# Altium project 单体V0.3.PrjPcb
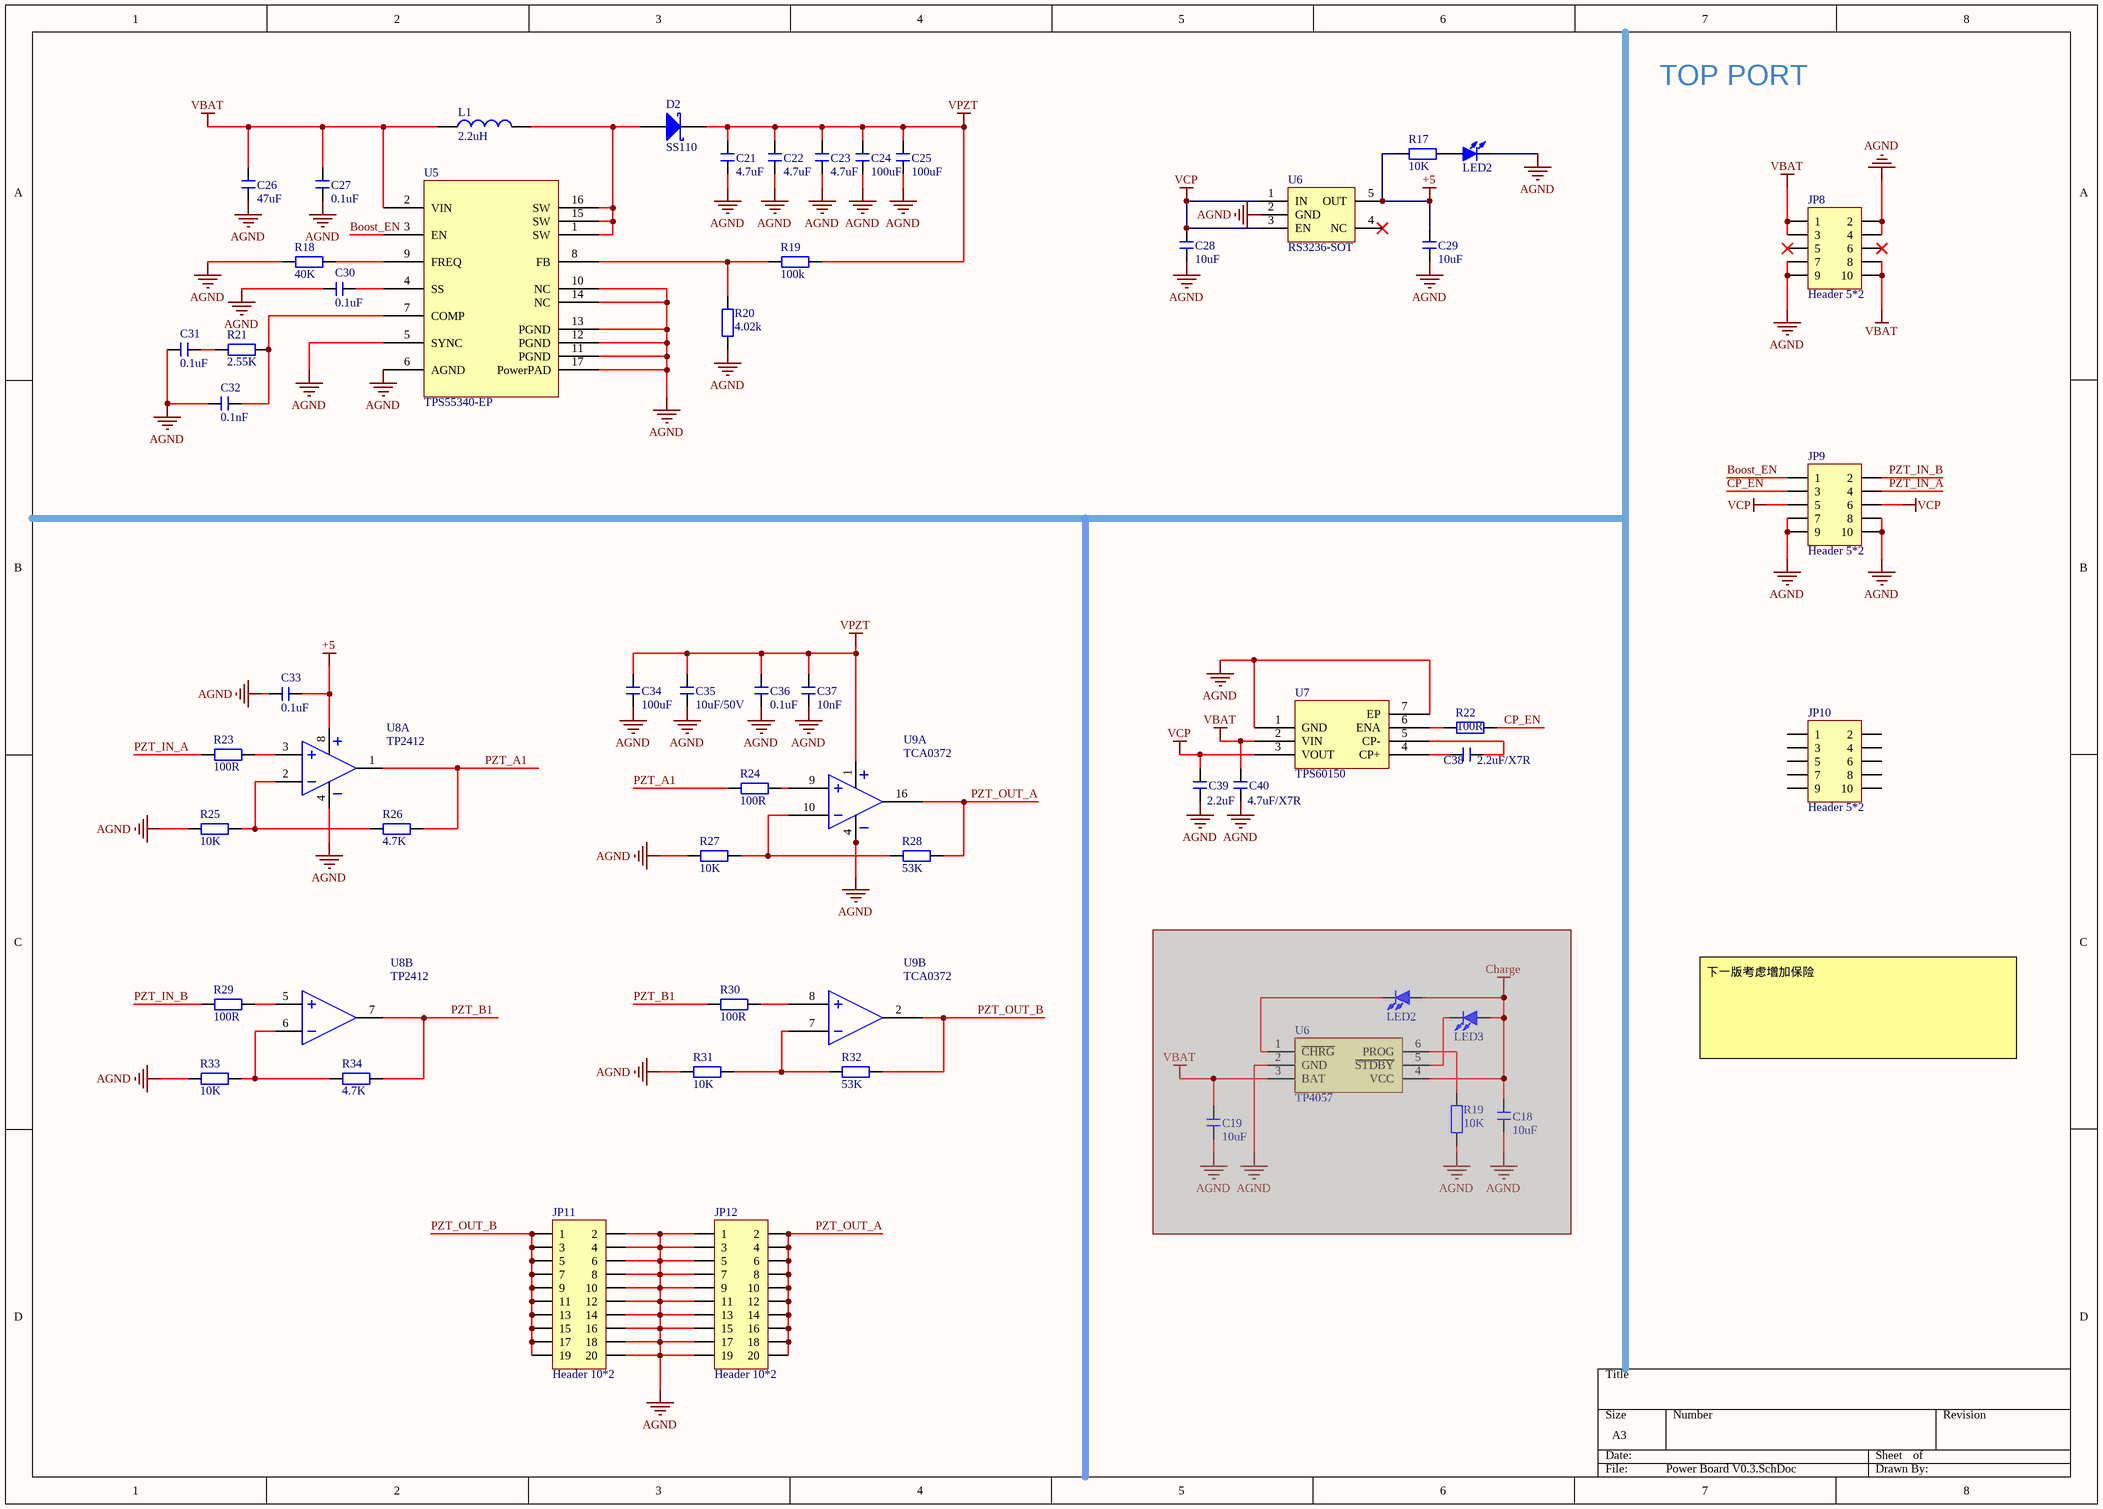
[diagram p0: Power Board V0.3.SchDoc]
2 sheets, 61 parts. Net scope: global (net labels, ports and power ports of the same name join across sheets).
Board files: Power Board V0.3.PcbDoc, Controller Board V0.3.PcbDoc, Function Board V0.3.PcbDoc, PZT Board.PcbDoc, DAP Board V0.3.PcbDoc
Sheets:
  Power Board V0.3.SchDoc
  DAP Board V0.3.SchDoc

## Sheet Power Board V0.3.SchDoc
size A3; SheetNumber: 1; SheetTotal: 4

### Parts
(Parts that share a designator on the sheet are numbered #1, #2 ... from top to bottom, then left to right.)
C18  10uF  [C 0603_L]  (masked out: inside a compile mask, not in the netlist)
C19  10uF  [C 0603_L]  (masked out: inside a compile mask, not in the netlist)
C21  4.7uF  [C 0603_L]
C22  4.7uF  [C 0603_L]
C23  4.7uF  [C 0603_L]
C24  100uF  [C 1206_L]
C25  100uF  [C 1206_L]
C26  47uF  [C 1206_L]
C27  0.1uF  [C 0603_L]
C28  10uF  [C 0603_L]
C29  10uF  [C 0603_L]
C30  0.1uF  [C 0603_L]
C31  0.1uF  [C 0603_L]
C32  0.1nF  [C 0603_L]
C33  0.1uF  [C 0603_L]
C34  100uF  [C 1206_L]
C35  10uF/50V  [C 0805_L]
C36  0.1uF  [C 0603_L]
C37  10nF  [C 0603_L]
C38  2.2uF/X7R  [C 0603_L]
C39  2.2uF  [C 0603_L]
C40  4.7uF/X7R  [C 0603_L]
D2  SS110  [SMA]
JP8  Header 5*2  [BTB-0.8mm-SMD-F-2*5PIN]
JP9  Header 5*2  [BTB-0.8mm-SMD-F-2*5PIN]
JP10  Header 5*2  [BTB-0.8mm-SMD-F-2*5PIN]
JP11  Header 10*2  [BTB-0.5MM-SMD-F_2*10PIN]
JP12  Header 10*2  [BTB-0.5MM-SMD-F_2*10PIN]
L1  2.2uH  [0530]
LED2#1  红色  [LED 0603G]  (value not drawn)
LED2#2  红色  [LED 0603R]  (value not drawn)  (masked out: inside a compile mask, not in the netlist)
LED3  红色  [LED 0603G]  (value not drawn)  (masked out: inside a compile mask, not in the netlist)
R17  10K  [R 0603_L]
R18  40K  [R 0603_L]
R19#1  100k  [R 0603_L]
R19#2  10K  [R 0603_L]  (masked out: inside a compile mask, not in the netlist)
R20  4.02k  [R 0603_L]
R21  2.55K  [R 0603_L]
R22  100R  [R 0603_L]
R23  100R  [R 0603_L]
R24  100R  [R 0603_L]
R25  10K  [R 0603_L]
R26  4.7K  [R 0603_L]
R27  10K  [R 0603_L]
R28  53K  [R 0603_L]
R29  100R  [R 0603_L]
R30  100R  [R 0603_L]
R31  10K  [R 0603_L]
R32  53K  [R 0603_L]
R33  10K  [R 0603_L]
R34  4.7K  [R 0603_L]
U5  TPS55340-EP  [QFN16]
U6#1  RS3236-SOT  [SOT23-5L]
U6#2  TP4057  [SOT23-6L]  (masked out: inside a compile mask, not in the netlist)
U7  TPS60150  [WSON-6Pin]
U8  TP2412  [MSOP8_L]  (parts A,B of 2)
U9  TCA0372  [SOP16W_N]  (parts A,B of 2)

### Nets
+5: C29.2 C33.2 R17.2 U6#1.5(OUT) U8.8(+Vs)
AGND: C21.1 C22.1 C23.1 C24.1 C25.1 C26.1 C27.1 C28.1 C29.1 C30.1 C31.1 C32.1 C33.1 C34.1 C35.1 C36.1 C37.2 C39.1 C40.1 JP8.2 JP8.4 JP8.7 JP8.9 JP9.7 JP9.8 JP9.9 JP9.10 JP11.2 JP11.4 JP11.6 JP11.8 JP11.10 JP11.12 JP11.14 JP11.16 JP11.18 JP11.20 JP12.1 JP12.3 JP12.5 JP12.7 JP12.9 JP12.11 JP12.13 JP12.15 JP12.17 JP12.19 LED2#1.2(K) R18.1 R20.1 R25.1 R27.1 R31.1 R33.1 U5.5(SYNC) U5.6(AGND) U5.10(NC) U5.11(PGND) U5.12(PGND) U5.13(PGND) U5.14(NC) U5.17(PowerPAD) U6#1.2(GND) U7.1(GND) U7.7(EP) U8.4(-Vs) U9.4(GND) U9.5(GND) U9.12(GND) U9.13(GND)
VBAT: C26.2 C27.2 C40.2 JP8.1 JP8.3 JP8.8 JP8.10 L1.1 U5.2(VIN) U7.2(VIN)
VCP: C28.2 C39.2 JP9.5 JP9.6 U6#1.1(IN) U6#1.3(EN) U7.3(VOUT)
VPZT: C21.2 C22.2 C23.2 C24.2 C25.2 C34.2 C35.2 C36.2 C37.1 D2.2(K) R19#1.2 U9.1
Boost_EN: JP9.1 U5.3(EN)
CP_EN: JP9.3 R22.1
PZT_A1: R24.1 R26.2 U8.1(Out)
PZT_B1: R30.1 R34.2 U8.7(Out)
PZT_IN_A: JP9.4 R23.1
PZT_IN_B: JP9.2 R29.1
PZT_OUT_A: JP12.2 JP12.4 JP12.6 JP12.8 JP12.10 JP12.12 JP12.14 JP12.16 JP12.18 JP12.20 R28.2 U9.16
PZT_OUT_B: JP11.1 JP11.3 JP11.5 JP11.7 JP11.9 JP11.11 JP11.13 JP11.15 JP11.17 JP11.19 R32.2 U9.2
NetC30_2: C30.2 U5.4(SS)
NetC31_2: C31.2 R21.1
NetC32_2: C32.2 R21.2 U5.7(COMP)
NetC38_1: C38.1 U7.4(CP+)
NetC38_2: C38.2 U7.5(CP-)
NetD2_1: D2.1(A) L1.2 U5.1(SW) U5.15(SW) U5.16(SW)
NetLED2#1_1: LED2#1.1(A) R17.1
NetR18_2: R18.2 U5.9(FREQ)
NetR19#1_1: R19#1.1 R20.2 U5.8(FB)
NetR22_2: R22.2 U7.6(ENA)
NetR23_2: R23.2 U8.3(In+)
NetR24_2: R24.2 U9.9
NetR25_2: R25.2 R26.1 U8.2(In-)
NetR27_2: R27.2 R28.1 U9.10
NetR29_2: R29.2 U8.5(In+)
NetR30_2: R30.2 U9.8
NetR31_2: R31.2 R32.1 U9.7
NetR33_2: R33.2 R34.1 U8.6(In-)

Not connected (* = marked no-connect by the designer): JP8 5* 6*; JP10 1 2 3 4 5 6 7 8 9 10; U6#1 4(NC)*

### Notes on the sheet
- TOP PORT
- 下一版考虑增加保险

### Library data of the parts
C18 C19 C21-C40 = C: 贴片电容; BOM名称: 无极性贴片电容; 淘宝ID: 封装库来自淘宝 ID：黄晶宝石; 联系售后: https://shop463601444.taobao.com
D2 = SS14: 肖特基二极管; 属性: 40V/1A; BOM名称: 肖特基二极管; 封装库来自淘宝 ID：黄晶宝石: https://shop463601444.taobao.com
JP8-JP10 = Header 5*2: BTB Connector
JP11 JP12 = Header 10*2: BTB Connector
L1 = L-: 一体成型电感; 淘宝ID: 封装库来自淘宝 ID：黄晶宝石; BOM名称: 一体成型电感; 联系售后: https://shop463601444.taobao.com
LED2#1 LED2#2 LED3 = LED-SMD: 贴片LED; 版权归属: 封装库来自淘宝 ID：黄晶宝石; BOM名称: 贴片LED; 学习资源: https://shop463601444.taobao.com
R17 R18 R19#1 R19#2 R20-R34 = R: 贴片电阻; 版权归属: 来自淘宝 ID：黄晶宝石; BOM名称: 贴片电阻; 联系售后: https://shop463601444.taobao.com
U5 = TPS55340-EP: 增强型集成式 5A、40V 宽输入范围升压/SEPIC/反激式直流/直流稳压器
U6#1 = RS3236-SOT: 500mA LDO
U6#2 = TP4057: 500ma双灯指示 防反接锂电池充电管理; 淘宝ID: 封装库来自淘宝 ID：黄晶宝石; BOM名称: 锂电池充电管理; 学习资源: https://shop463601444.taobao.com
U7 = TPS60150: 采用2*2SON封装的140mA、5V电荷泵
U8 = TP2412: 10MHz Bandwidth, Low Noise Precision Op‐amps

## Sheet DAP Board V0.3.SchDoc
size A4; SheetNumber: 5; SheetTotal: 5
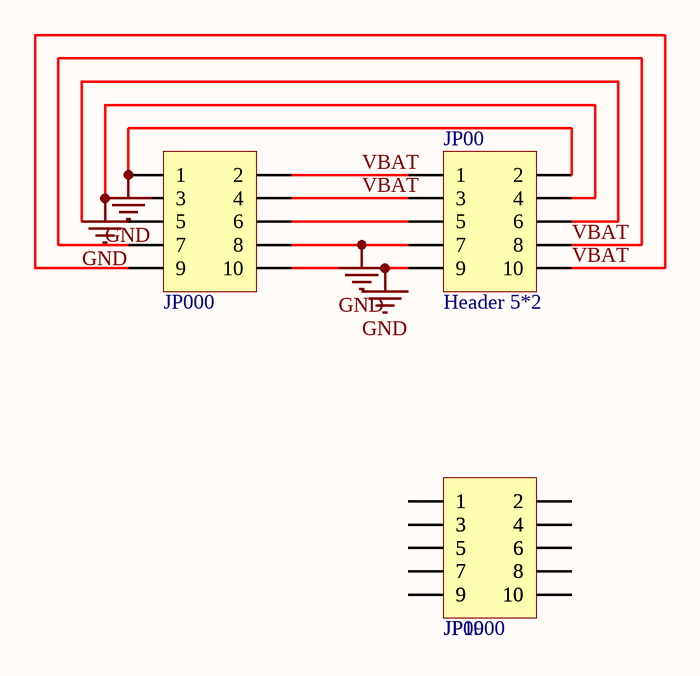
[diagram p1: DAP Board V0.3.SchDoc]

### Parts
JP00  Header 5*2  [BTB-0.8MM-SMD-BM-2*5PIN]
JP0000  Header 5X2  [HDR2.54-M-LS-2x5P]  (value not drawn)
JP000  Header 5X2  [HDR1.27-M-LS-2x5P]  (value not drawn)
JP19  Header 5X2  [HDR1.27-M-LS-2x5P]  (value not drawn)

### Nets
GND: JP000.1 JP00.2 JP000.3 JP00.4 JP00.7 JP000.8 JP00.9 JP000.10
VBAT: JP00.1 JP000.2 JP00.3 JP000.4 JP000.7 JP00.8 JP000.9 JP00.10
NetJP0000_1: JP0000.1 JP19.1
NetJP0000_2: JP0000.2 JP19.2
NetJP0000_3: JP0000.3 JP19.3
NetJP0000_4: JP0000.4 JP19.4
NetJP00_5: JP00.5 JP000.6
NetJP000_5: JP000.5 JP00.6
NetJP0000_5: JP0000.5 JP19.5
NetJP0000_6: JP0000.6 JP19.6
NetJP0000_7: JP0000.7 JP19.7
NetJP0000_8: JP0000.8 JP19.8
NetJP0000_9: JP0000.9 JP19.9
NetJP0000_10: JP0000.10 JP19.10

### Library data of the parts
JP00 = Header 5*2: BTB Connector
JP0000 JP000 JP19 = Header 5X2: 5*2P接插件; 版权归属: 封装库来自淘宝 ID：黄晶宝石; BOM名称: 5*2P接插件; 学习资源: https://shop463601444.taobao.com

## Nets that join several sheets
VBAT: Power Board V0.3 (10 pins), DAP Board V0.3 (8 pins)